# EasyEDA schematic 1-schematic.json
TITLE: LEAP#541 TL431 Multivibrator; REV: 1.0; Date: 2020-04-07; Sheet: 1/1; Drawn By: tardate; Company: leap.tardate.com
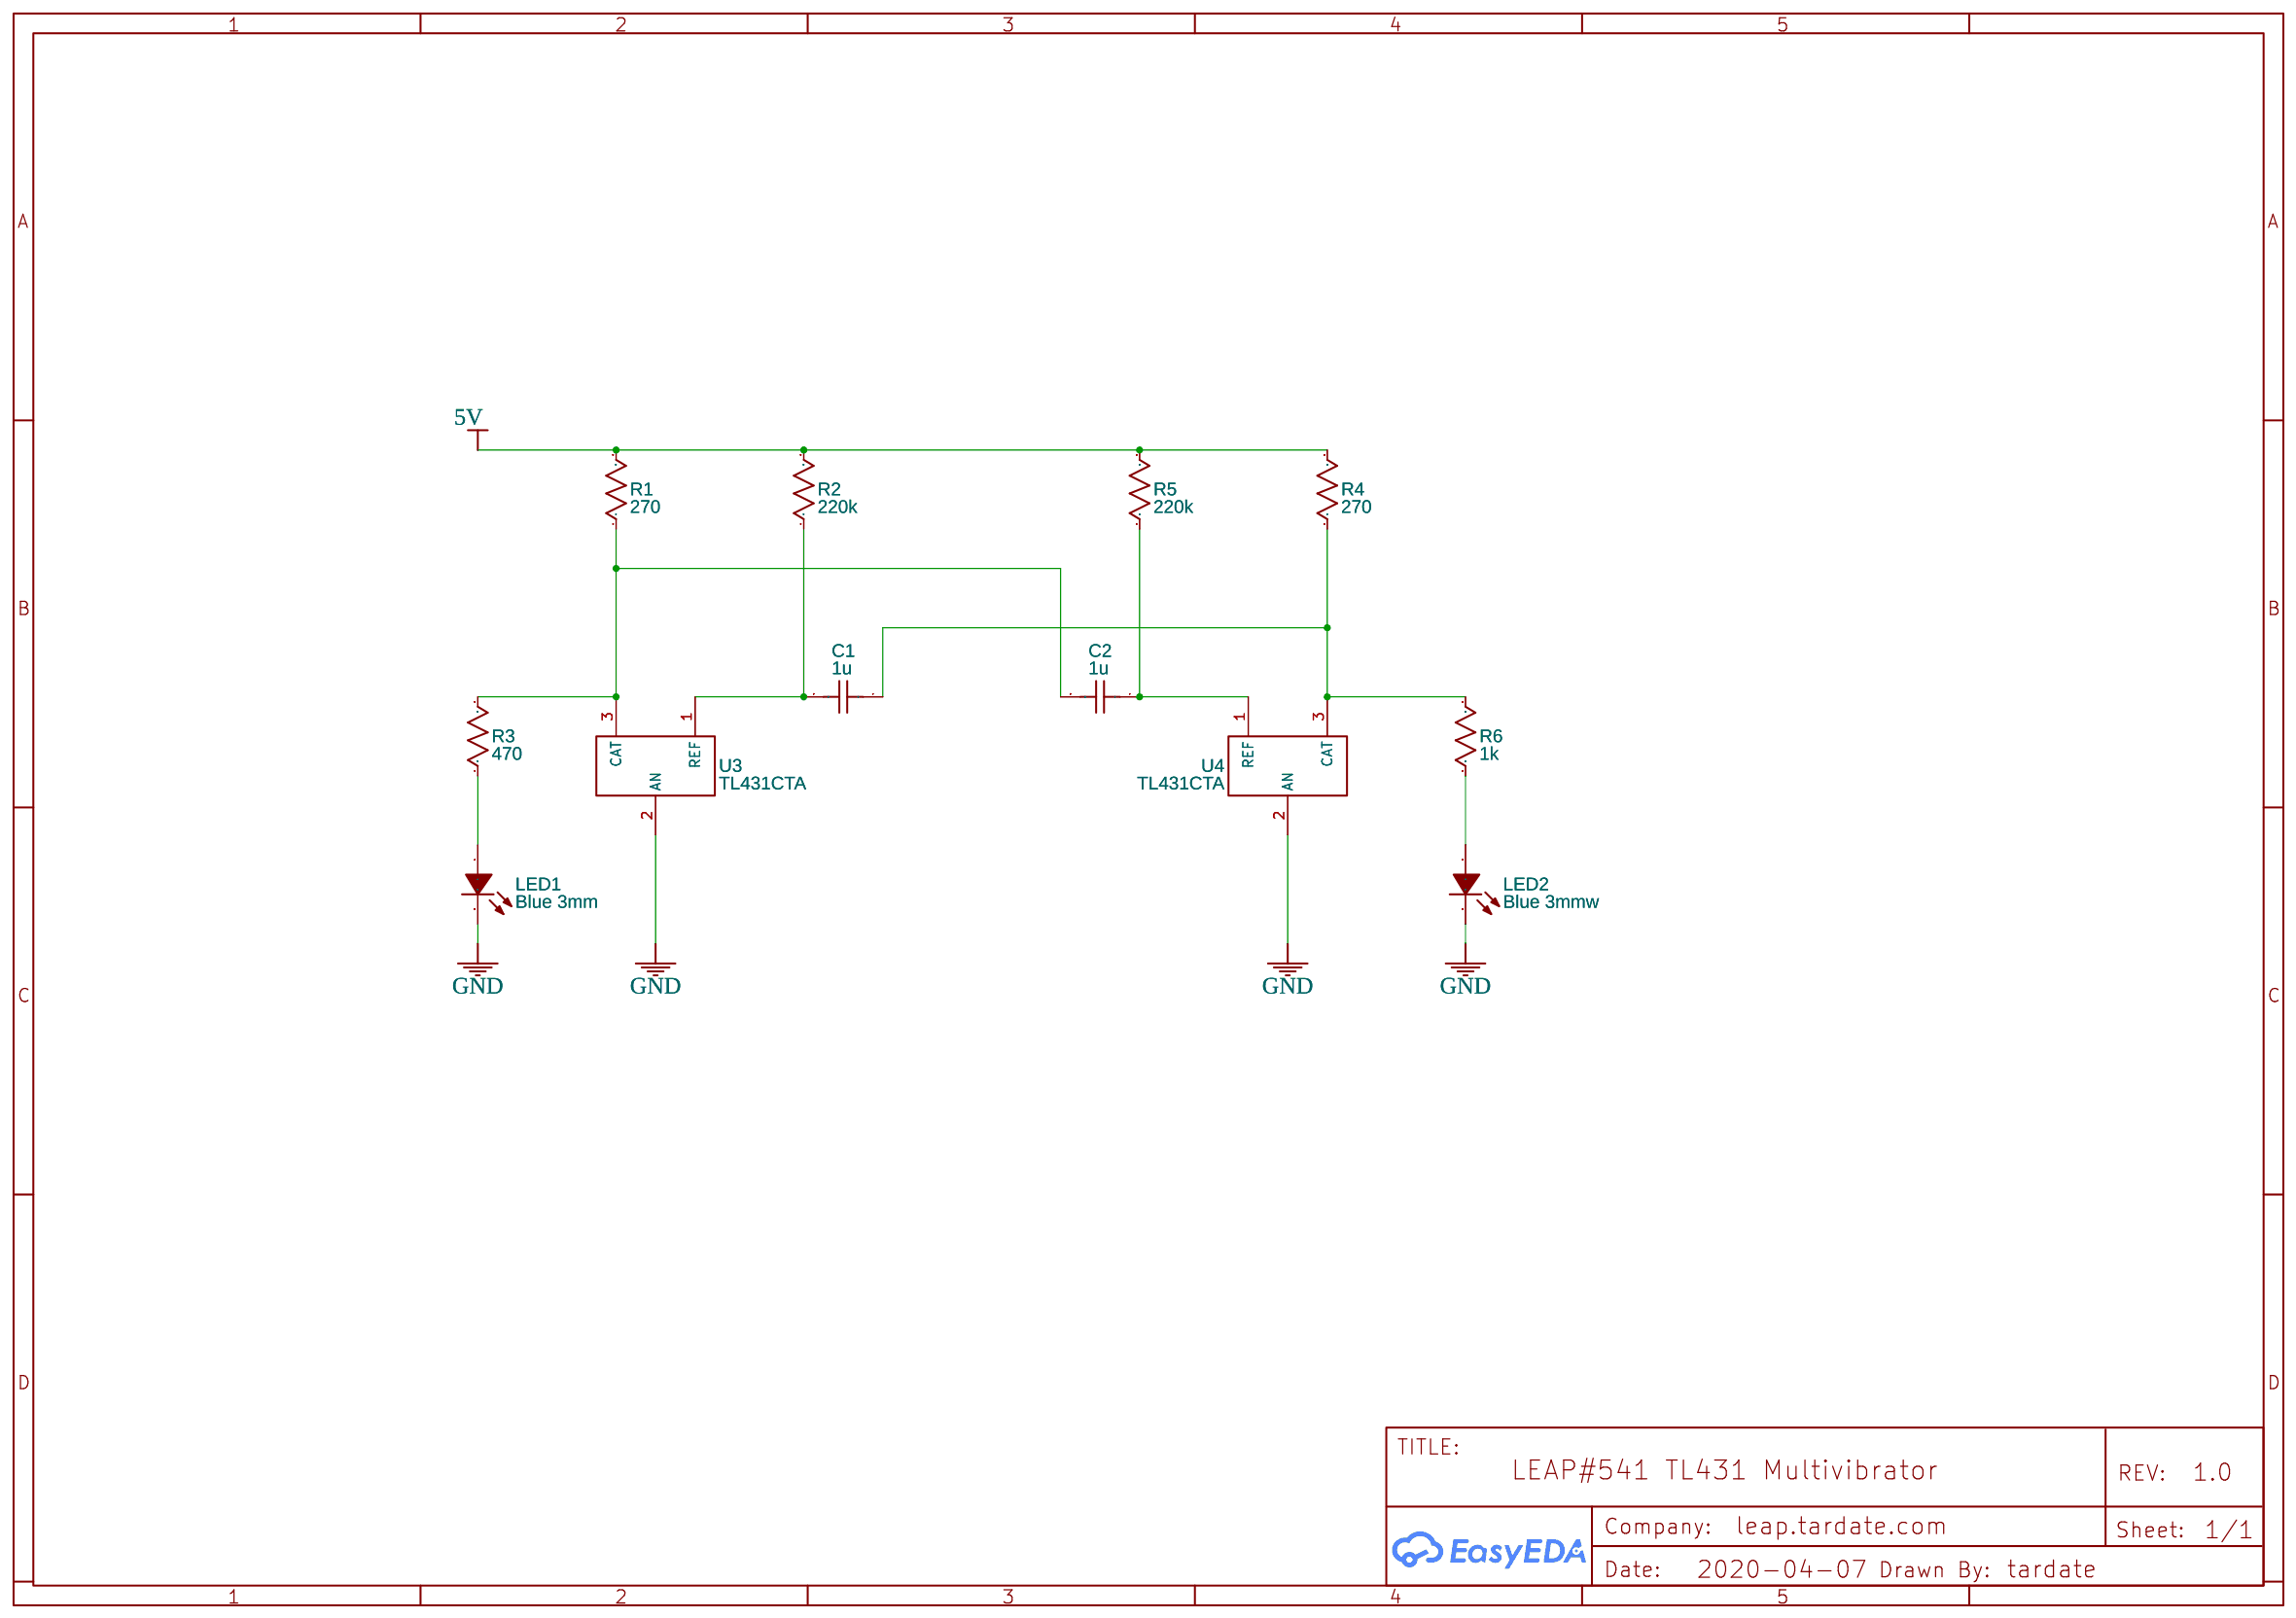
[diagram p0: schematic sheet]

## Parts
#1  -
C1  1u  [RAD-0.1]
C2  1u  [RAD-0.1]
LED1  Blue 3mm  [LED-3MM/2.54]
LED2  Blue 3mmw  [LED-3MM/2.54]
R1  270  [AXIAL-0.3]
R2  220k  [AXIAL-0.3]
R3  470  [AXIAL-0.3]
R4  270  [AXIAL-0.3]
R5  220k  [AXIAL-0.3]
R6  1k  [AXIAL-0.3]
U3  TL431CTA  [TO-92-3_L4.8-W3.7-P2.54-L]
U4  TL431CTA  [TO-92-3_L4.8-W3.7-P2.54-L]

## Library data of the parts
#1 = -: BOM_Manufacturer Part: ?
C1 C2 = Cap_RAD-0.1_US
LED1 LED2 = 204-10SURD/S530-A3: Supplier: LCSC; Manufacturer: EVERLIGHT; Supplier Part: C99772
R1-R6 = Res_AXIAL-0.3(1/8W)_US
U3 U4 = TL431CTA: Supplier: LCSC; Manufacturer: HTC; Contributor: LCSC; Supplier Part: C126098

## Nets
5V: R1.2 R2.2 R4.2 R5.2
GND: LED1.2(K) LED2.2(K) U3.2(AN) U4.2(AN)
Net-(C1-1): C1.1 R4.1 R6.2 U4.3(CAT)
Net-(C1-2): C1.2 R2.1 U3.1(REF)
Net-(C2-1): C2.1 R5.1 U4.1(REF)
Net-(C2-2): C2.2 R1.1 R3.2 U3.3(CAT)
Net-(LED1-1): LED1.1(A) R3.1
Net-(LED2-1): LED2.1(A) R6.1
